# Altium project ESP32_RC_Mod_V1.PrjPcb
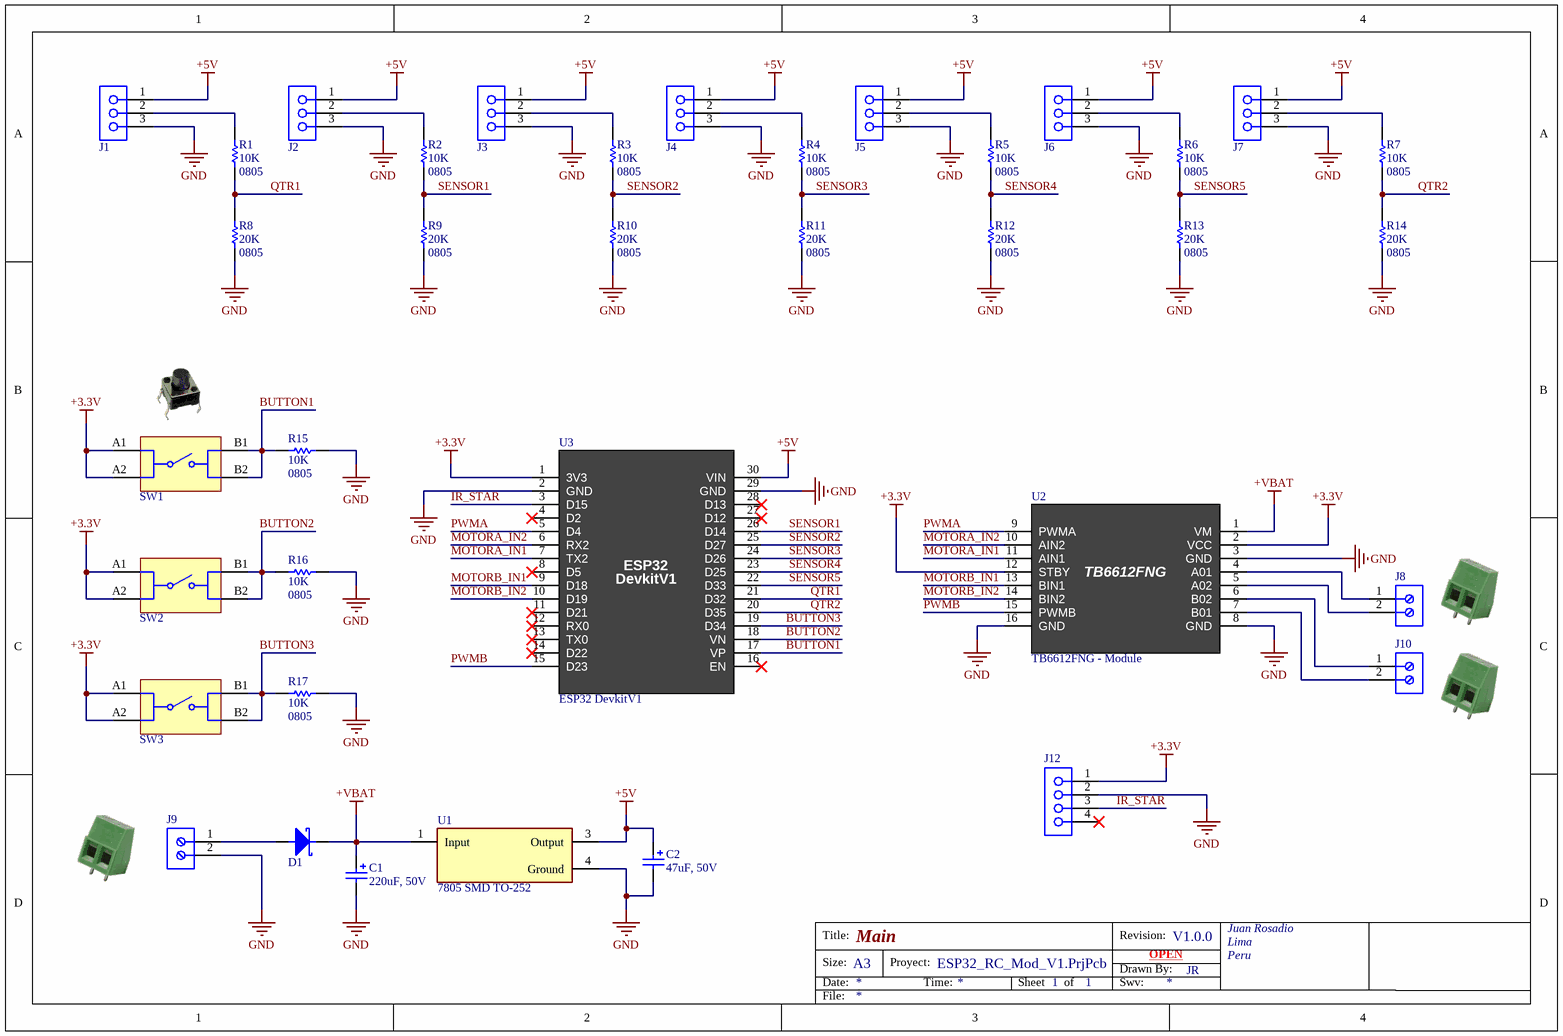
[diagram p0: ESP32_RC_MOD_V1.SchDoc]
CAGE_CODE: ?????; CONTRACT_NUMBER: <CONTRACT NO>; DOC_NO_ASSY_DWG: <ASSY DWG NO>; DOC_NO_BOM: <BOM DOC NO>; DOC_NO_FAB_DWG: <FAB DWG NO>; DOC_NO_SCH_DWG: <SCH DWG NO>; PCB_2_DEC_TOL: +/-.01; PCB_3_DEC_TOL: +/-.010; PCB_ANG_TOL: +/-1/2; PCB_ASSEMBLY_NO: <PCB ASSY NO>; PCB_CHECKER: - -----; PCB_CHECKER_APP_DATE: --/--/----; PCB_DESIGNER: - -----; PCB_DESIGNER_APP_DATE: --/--/----; PCB_DWG_NO: <PCB DWG NO>; PCB_ENGINEER: - -----; PCB_ENGINEER_APP_DATE: --/--/----; PCB_PART_NUMBER: <PCB PN>; PCB_REV: A; SCH_REV: A
1 sheet, 37 parts. Net scope: global (net labels, ports and power ports of the same name join across sheets).
Board file: ESP32_RC_MOD_V1.PcbDoc

## Sheet ESP32_RC_MOD_V1.SchDoc: Main
size A4; DrawnBy: JR; Organization: Juan Rosadio; Address1: Lima; Address2: Peru; Revision: V1.0.0; SheetNumber: 1; SheetTotal: 1; ENG_APP_DATE: --/--/--; DSN_APP_DATE: --/--/--; CHK_APP_DATE: --/--/--; License: OPEN

### Parts
C1  220uF, 50V  [WCAP-ATG8_D10H12.5]
C2  47uF, 50V  [WCAP-ATG8_D6.3H11]
D1  Diode Schottky  [DO-214AB]  (value not drawn)
J1  Header 3P  [61300311821]  (value not drawn)
J2  Header 3P  [61300311821]  (value not drawn)
J3  Header 3P  [61300311821]  (value not drawn)
J4  Header 3P  [61300311821]  (value not drawn)
J5  Header 3P  [61300311821]  (value not drawn)
J6  Header 3P  [61300311821]  (value not drawn)
J7  Header 3P  [61300311821]  (value not drawn)
J8  Bornera de 2 pines  [691111710002]  (value not drawn)
J9  Bornera de 2 pines  [691111710002]  (value not drawn)
J10  Bornera de 2 pines  [691111710002]  (value not drawn)
J12  Header 4p  [61300411821]  (value not drawn)
R1  Resistance: 10K  Case/Package: 0805  [RES0805A]  (hidden comment: Resistor 0805)
R2  Resistance: 10K  Case/Package: 0805  [RES0805A]  (hidden comment: Resistor 0805)
R3  Resistance: 10K  Case/Package: 0805  [RES0805A]  (hidden comment: Resistor 0805)
R4  Resistance: 10K  Case/Package: 0805  [RES0805A]  (hidden comment: Resistor 0805)
R5  Resistance: 10K  Case/Package: 0805  [RES0805A]  (hidden comment: Resistor 0805)
R6  Resistance: 10K  Case/Package: 0805  [RES0805A]  (hidden comment: Resistor 0805)
R7  Resistance: 10K  Case/Package: 0805  [RES0805A]  (hidden comment: Resistor 0805)
R8  Resistance: 20K  Case/Package: 0805  [RES0805A]  (hidden comment: Resistor 0805)
R9  Resistance: 20K  Case/Package: 0805  [RES0805A]  (hidden comment: Resistor 0805)
R10  Resistance: 20K  Case/Package: 0805  [RES0805A]  (hidden comment: Resistor 0805)
R11  Resistance: 20K  Case/Package: 0805  [RES0805A]  (hidden comment: Resistor 0805)
R12  Resistance: 20K  Case/Package: 0805  [RES0805A]  (hidden comment: Resistor 0805)
R13  Resistance: 20K  Case/Package: 0805  [RES0805A]  (hidden comment: Resistor 0805)
R14  Resistance: 20K  Case/Package: 0805  [RES0805A]  (hidden comment: Resistor 0805)
R15  Resistance: 10K  Case/Package: 0805  [RES0805A]  (hidden comment: Resistor 0805)
R16  Resistance: 10K  Case/Package: 0805  [RES0805A]  (hidden comment: Resistor 0805)
R17  Resistance: 10K  Case/Package: 0805  [RES0805A]  (hidden comment: Resistor 0805)
SW1  XUNPU TS-1002S-07026C  [4301x60707x6]  (value not drawn)
SW2  XUNPU TS-1002S-07026C  [4301x60707x6]  (value not drawn)
SW3  XUNPU TS-1002S-07026C  [4301x60707x6]  (value not drawn)
U1  7805 SMD TO-252  [FP-369C-MFG]
U2  TB6612FNG - Module  [TB6612FNG-HDR-3D]
U3  ESP32 DevkitV1  [ESP32 DEVKITV1 - HDR - 3D]

### Nets
+3.3V: J12.1 SW1.A1 SW1.A2 SW2.A1 SW2.A2 SW3.A1 SW3.A2 U2.2(VCC) U2.12(STBY) U3.1(3V3)
+5V: C2.1(P) J1.1 J2.1 J3.1 J4.1 J5.1 J6.1 J7.1 U1.3(Output) U3.30(VIN)
+VBAT: C1.1(P) D1.2(K) U1.1(Input) U2.1(VM)
GND: C1.2(N) C2.2(N) J1.3 J2.3 J3.3 J4.3 J5.3 J6.3 J7.3 J9.2 J12.2 R8.1 R9.1 R10.1 R11.1 R12.1 R13.1 R14.1 R15.1 R16.1 R17.1 U1.4(Ground) U2.3(GND) U2.8(GND) U2.16(GND) U3.2(GND) U3.29(GND)
BUTTON1: R15.2 SW1.B1 SW1.B2 U3.17(VP)
BUTTON2: R16.2 SW2.B1 SW2.B2 U3.18(VN)
BUTTON3: R17.2 SW3.B1 SW3.B2 U3.19(D34)
IR_STAR: J12.3 U3.3(D15)
MOTORA_IN1: U2.11(AIN1) U3.7(TX2)
MOTORA_IN2: U2.10(AIN2) U3.6(RX2)
MOTORB_IN1: U2.13(BIN1) U3.9(D18)
MOTORB_IN2: U2.14(BIN2) U3.10(D19)
PWMA: U2.9(PWMA) U3.5(D4)
PWMB: U2.15(PWMB) U3.15(D23)
QTR1: R1.1 R8.2 U3.21(D32)
QTR2: R7.1 R14.2 U3.20(D35)
SENSOR1: R2.1 R9.2 U3.26(D14)
SENSOR2: R3.1 R10.2 U3.25(D27)
SENSOR3: R4.1 R11.2 U3.24(D26)
SENSOR4: R5.1 R12.2 U3.23(D25)
SENSOR5: R6.1 R13.2 U3.22(D33)
NetD1_1: D1.1(A) J9.1
NetJ1_2: J1.2 R1.2
NetJ2_2: J2.2 R2.2
NetJ3_2: J3.2 R3.2
NetJ4_2: J4.2 R4.2
NetJ5_2: J5.2 R5.2
NetJ6_2: J6.2 R6.2
NetJ7_2: J7.2 R7.2
NetJ8_1: J8.1 U2.4(A01)
NetJ8_2: J8.2 U2.5(A02)
NetJ10_1: J10.1 U2.6(B02)
NetJ10_2: J10.2 U2.7(B01)

Not connected (* = marked no-connect by the designer): J12 4*; U3 4(D2)* 8(D5)* 11(D21)* 12(RX0)* 13(TX0)* 14(D22)* 16(EN)* 27(D12)* 28(D13)*

### Notes on the sheet
- Title:
- Size:
- Date:
- A3
- Proyect:
- Time:
- Sheet
- of
- Revision:
- Drawn By:
- Swv:
- File:
- (in symbol ESP32 DevkitV1) ESP32; DevkitV1
- (in symbol TB6612FNG - Module) TB6612FNG

### Library data of the parts
C1 = 860010675018: WCAP-ATG8 Aluminum Electrolytic Capacitor, Radial, THT, D10xH12.5, 220uF, 50V; Manufacturer: Wurth Elektronik; Ripple Current: 468mA; Rated Voltage: 50VDC; Technical Reference: ATBF125221M050DSPA9B000; Leakage Current: 110uA; Endurance: 2000h; Dissipation Factor: 10%; Capacitance Tolerance: +/-20%; ComponentLink2Description: Datasheet; Published Date: October 2020; Packaging: Ammo Pack; Operating Temperature: -40 to +85degC; Mounting Technology: THT; Manufacturer Part Number: 860010675018; Height: 12.5mm; Diameter: 10mm; ComponentLink2URL: https://www.we-online.com/catalog/datasheet/860010675018.pdf; ComponentLink1URL: http://www.we-online.de; ComponentLink1Description: Manufacturer; Capacitance: 220uF
C2 = 860010673012: WCAP-ATG8 Aluminum Electrolytic Capacitor, Radial, THT, D6.3xH11, 47uF, 50V; Manufacturer: Wurth Elektronik; Ripple Current: 165mA; Rated Voltage: 50VDC; Technical Reference: ATBD110470M050DSPA4B000; Leakage Current: 23.5uA; Endurance: 2000h; Dissipation Factor: 10%; Capacitance Tolerance: +/-20%; ComponentLink2Description: Datasheet; Published Date: October 2020; Packaging: Ammo Pack; Operating Temperature: -40 to +85degC; Mounting Technology: THT; Manufacturer Part Number: 860010673012; Height: 11mm; Diameter: 6.3mm; ComponentLink2URL: https://www.we-online.com/catalog/datasheet/860010673012.pdf; ComponentLink1URL: http://www.we-online.de; ComponentLink1Description: Manufacturer; Capacitance: 47uF
D1 = Diode Schottky: Diodo Schottky SS36 3A 60 V; Voltage Rating (DC): 40V; Forward Current: 4A; Manufacturer 1: *; Manufacturer Part Number 1: *; Supplier Part Number 1: *; Supplier 1: *; Case/Package: *; Category: Rectifier Diodes
J1-J7 = 61300311821: WR-PHD Socket Header, THT, Vertical, pitch 2.54mm, 1 Row, 3P; Manufacturer: Wurth Elektronik; Contact Resistance: 20mOhm; Rated Current: 3A; Working Voltage: 250V; Withstanding Voltage: 500V; Manufacturer Part Number: 61300311821; Category: Board-to-Board Connectors; Match Code: WR-PHD; ComponentLink1Description: Website Link; ComponentLink1URL: https://www.we-online.com/redexpert/article/61300311821?ad; ComponentLink2Description: Datasheet Link; ComponentLink2URL: https://www.we-online.com/redexpert/spec/61300311821?ad; Mount: Through Hole; Operating Temperature Max: 125°C; Operating Temperature Min: -40°C; Packaging: Tray; Gender: Socket Header; Number of Pins: 3; Number of Rows: 1; Orientation: Vertical; Pitch: 2.54mm
J8-J10 = 691111710002: WR-TBL Serie 111 Horizontal Entry Modular, Pressure Clamp, THT, pitch 5mm, 2p; Manufacturer: Wurth Elektronik; Modularity: Yes; PCB/Cable/Panel: PCB; Pin Number: 2; Rated Current [UL]: 15A; Working Voltage [UL]: 250VAC; ComponentLink1Description: Manufacturer; ComponentLink1URL: http://www.we-online.de; ComponentLink2URL: https://katalog.we-online.de/em/datasheet/691111710002.pdf; ComponentLink2Description: Datasheet; Mounting Technology: THT; Manufacturer Part Number: 691111710002; Packaging: Box; Operating Temperature: -40 to +105degC; Pitch: 5mm; Published Date: Feburary 2021; Type: Horizontal; Application: Pressure Clamp
J12 = 61300411821: WR-PHD Socket Header, THT, pitch 2.54mm, Single Row, Vertical, 4p; Manufacturer: Wurth Elektronik; Pin Number: 4; Rated Current: 3A; Working Voltage: 250VAC; Withstanding Voltage: 500VAC; Contact Resistance: 20mOhm; ComponentLink1Description: Manufacturer; ComponentLink1URL: http://www.we-online.de; ComponentLink2Description: Datasheet; ComponentLink2URL: https://www.we-online.com/catalog/datasheet/61300411821.pdf; Manufacturer Part Number: 61300411821; Published Date: May 2020; Pitch: 2.54mm; Operating Temperature: -40 to +125degC; Mounting Technology: THT; Packaging: Tray; Gender: Socket Header; Row Number: Single; Orientation: Vertical
R1-R7 R15-R17 = Resistor 0805: SMD 0805 10Kohms; Tolerance: 1%; Power Rating: 125mW; Manufacturer 1: *; Manufacturer Part Number 1: *; Category: Chip SMD Resistors; Mount: Surface Mount; Case Code (Metric): 2012; Supplier Part Number 1: *; Supplier 1: *
R8-R14 = Resistor 0805: SMD 0805 20Kohms; Tolerance: 1%; Power Rating: 125mW; Manufacturer 1: *; Manufacturer Part Number 1: *; Category: Chip SMD Resistors; Mount: Surface Mount; Case Code (Metric): 2012; Supplier Part Number 1: *; Supplier 1: *
SW1-SW3 = 430156070726: 6mm 7mm Round Button 50mA Brick nogging 6mm SPST 12V SMD,6x6mm Tactile Switches ROHS; Match Code: WS-TATV; Circuit: SPST-NO; Operation Force: 260g; Rated Voltage: 12VDC; Washable: No; ComponentLink1Description: Website Link; ComponentLink1URL: https://www.we-online.com/redexpert/article/430156070726?ad; ComponentLink2Description: Datasheet Link; ComponentLink2URL: https://www.we-online.com/redexpert/spec/430156070726?ad; Manufacturer Part Number: TS-1002S-07026C; Category: Tact Switches; Manufacturer: XUNPU; Mount: Through Hole; Operating Temperature Max: 85°C; Operating Temperature Min: -40°C; Packaging: Bulk; Length: 6mm; Width: 6mm; Height: 7mm; Contact Material: Stainless Steel; Contact Plating: Silver; Rated Current: 50mA; Terminal Material: Copper Alloy; Terminal Plating: Silver; Supplier: LCSC; Supplier Part Number: C455114
U1 = CMP-07128-000005-1: IC REG LINEAR 5V 1A DPAK; Manufacturer: ON Semiconductor; Manufacturer Part Number: MC7805CDTG; Number Of Outputs: 1; Standoff Height: 0mm; Output Type: Fixed; Nominal Supply Current: 3.2mA; Dropout Voltage: 2V; Max Supply Voltage: 35V; Max Junction Temp: +125°C; Min Supply Voltage: 7V; Mouser Description: Linear Voltage Regulator, Positive, 5.0 V, 1.0 A, V out : 5.0 V; T J = 0Â°C to +125Â°C; Package: 369C; Output Voltage: 5V; Octopart: https://octopart.com/mc7805cdtg-on+semiconductor-1266408; Lead Free: Yes; Temperature Range Low: 0°C; Automotive: No; Temperature Range High: +125°C; Temperature: 0°C to +125°C; RoHS: TRUE; ComponentLink2Description: Datasheet; ComponentLink2URL: https://www.onsemi.cn/PowerSolutions/document/MC7800-D.PDF; Device Class L3: Voltage Regulators - Linear; Footprint Url: https://www.onsemi.com/pub/Collateral/369C.PDF; Device Class L1: Integrated Circuits (ICs); Digikey Description: IC REG LINEAR 5V 1A DPAK; Output Current: 1A; Device Class L2: Power Management ICs; Height: 2.51mm; Category: IC
U2 = TB6612FNG - Module: Driver Puente H TB6612FNG 1.2A
U3 = ESP32 DevkitV1: ESP32 DEVKIT V1 Wireless WiFi Bluetooth Placa de desarrollo Micro USB Dual Core